# Altium schematic sheet 0064_HPD & WAKE SIGNALS.SchDoc
size 848 x 558 mm
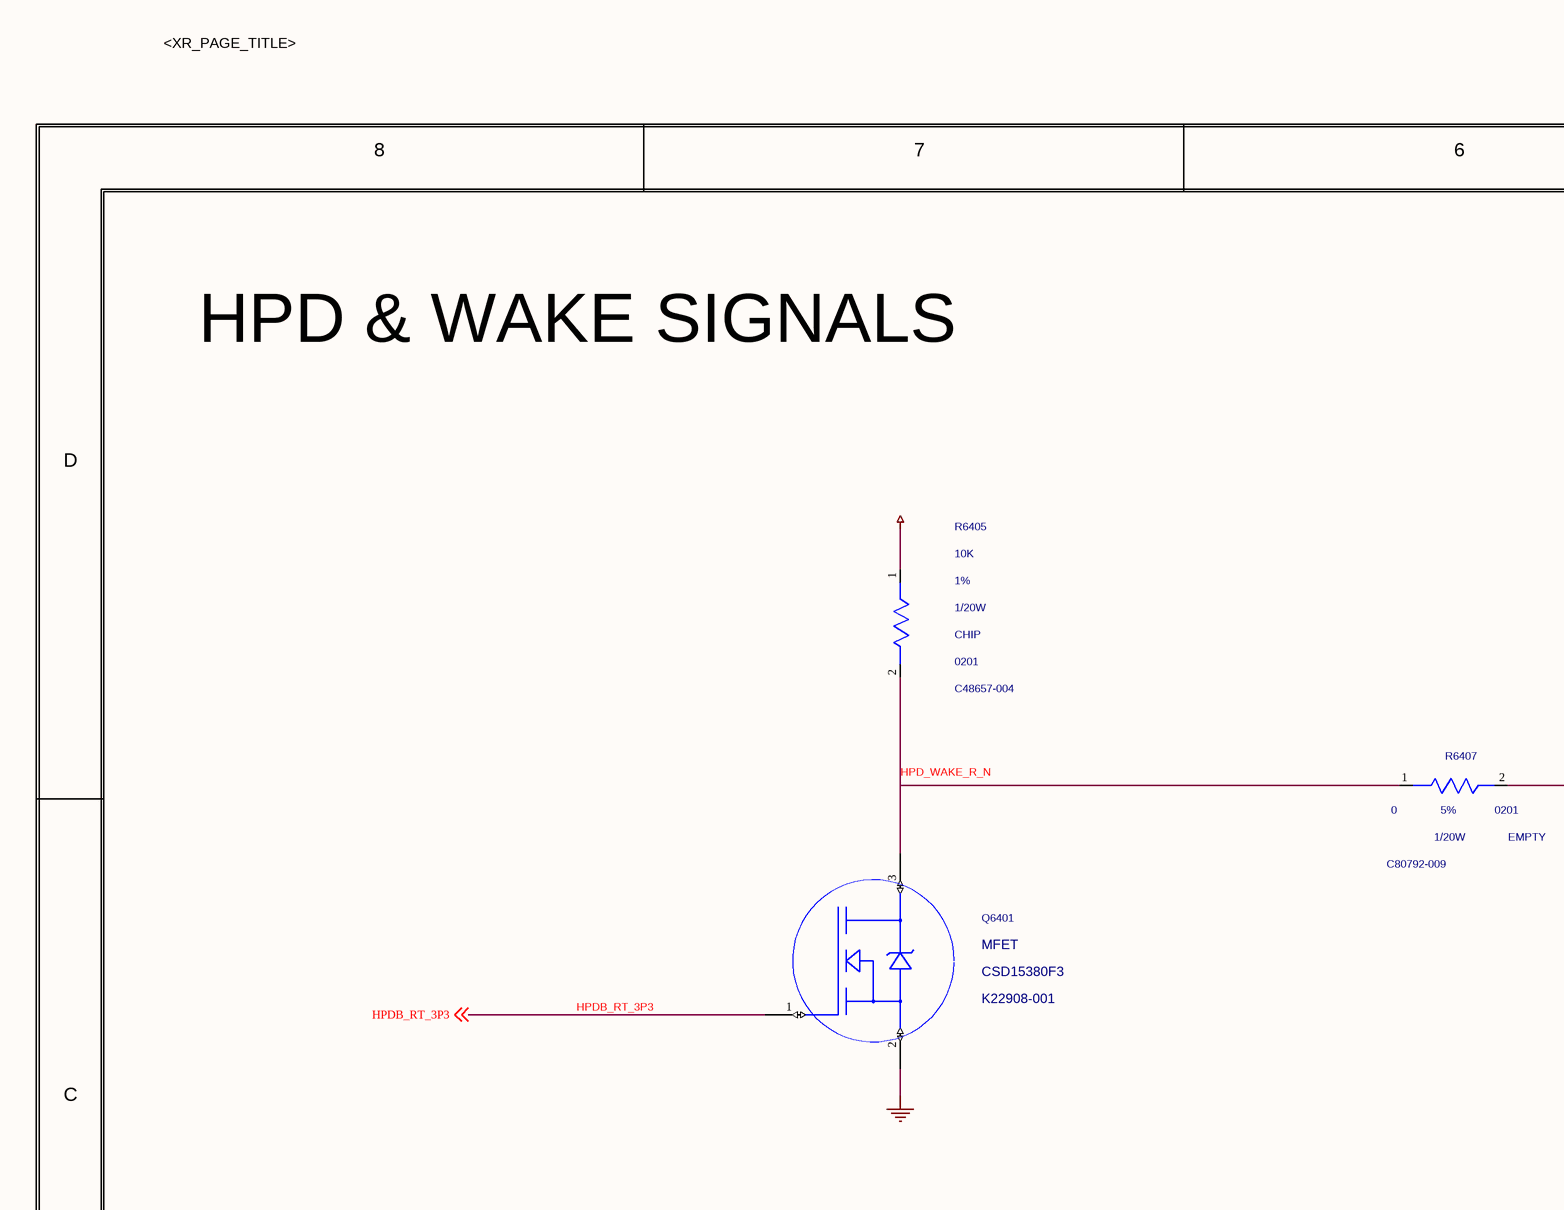
[diagram p0: 0064_HPD & WAKE SIGNALS.SchDoc, top left]
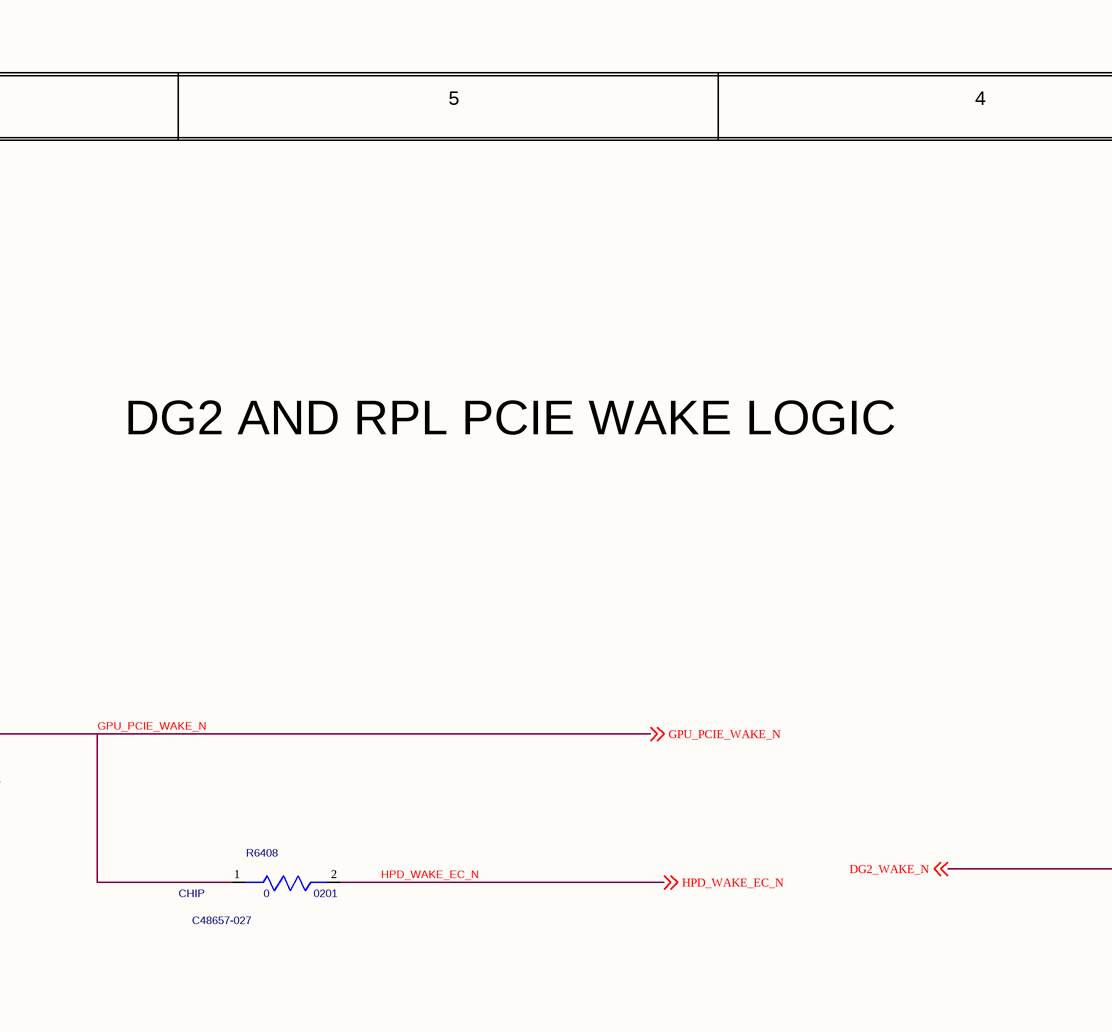
[diagram p1: 0064_HPD & WAKE SIGNALS.SchDoc, top middle]
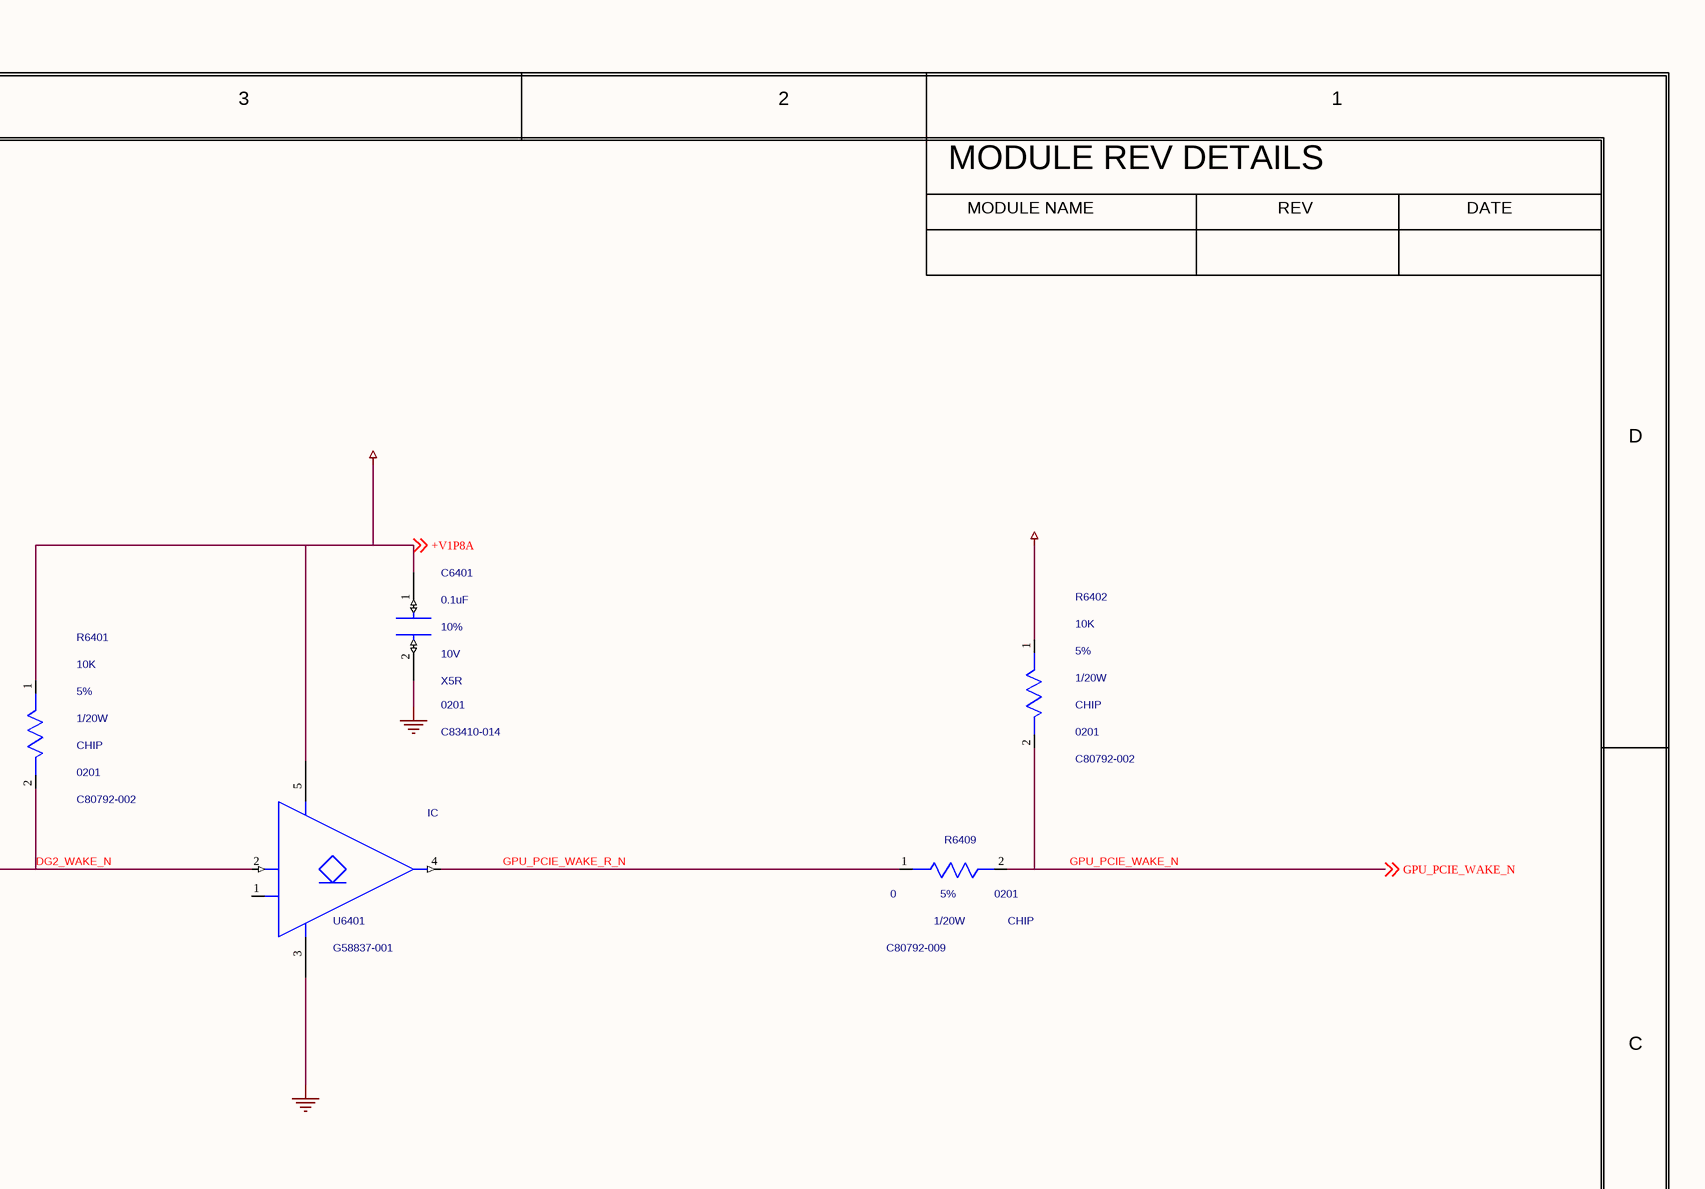
[diagram p2: 0064_HPD & WAKE SIGNALS.SchDoc, top right]
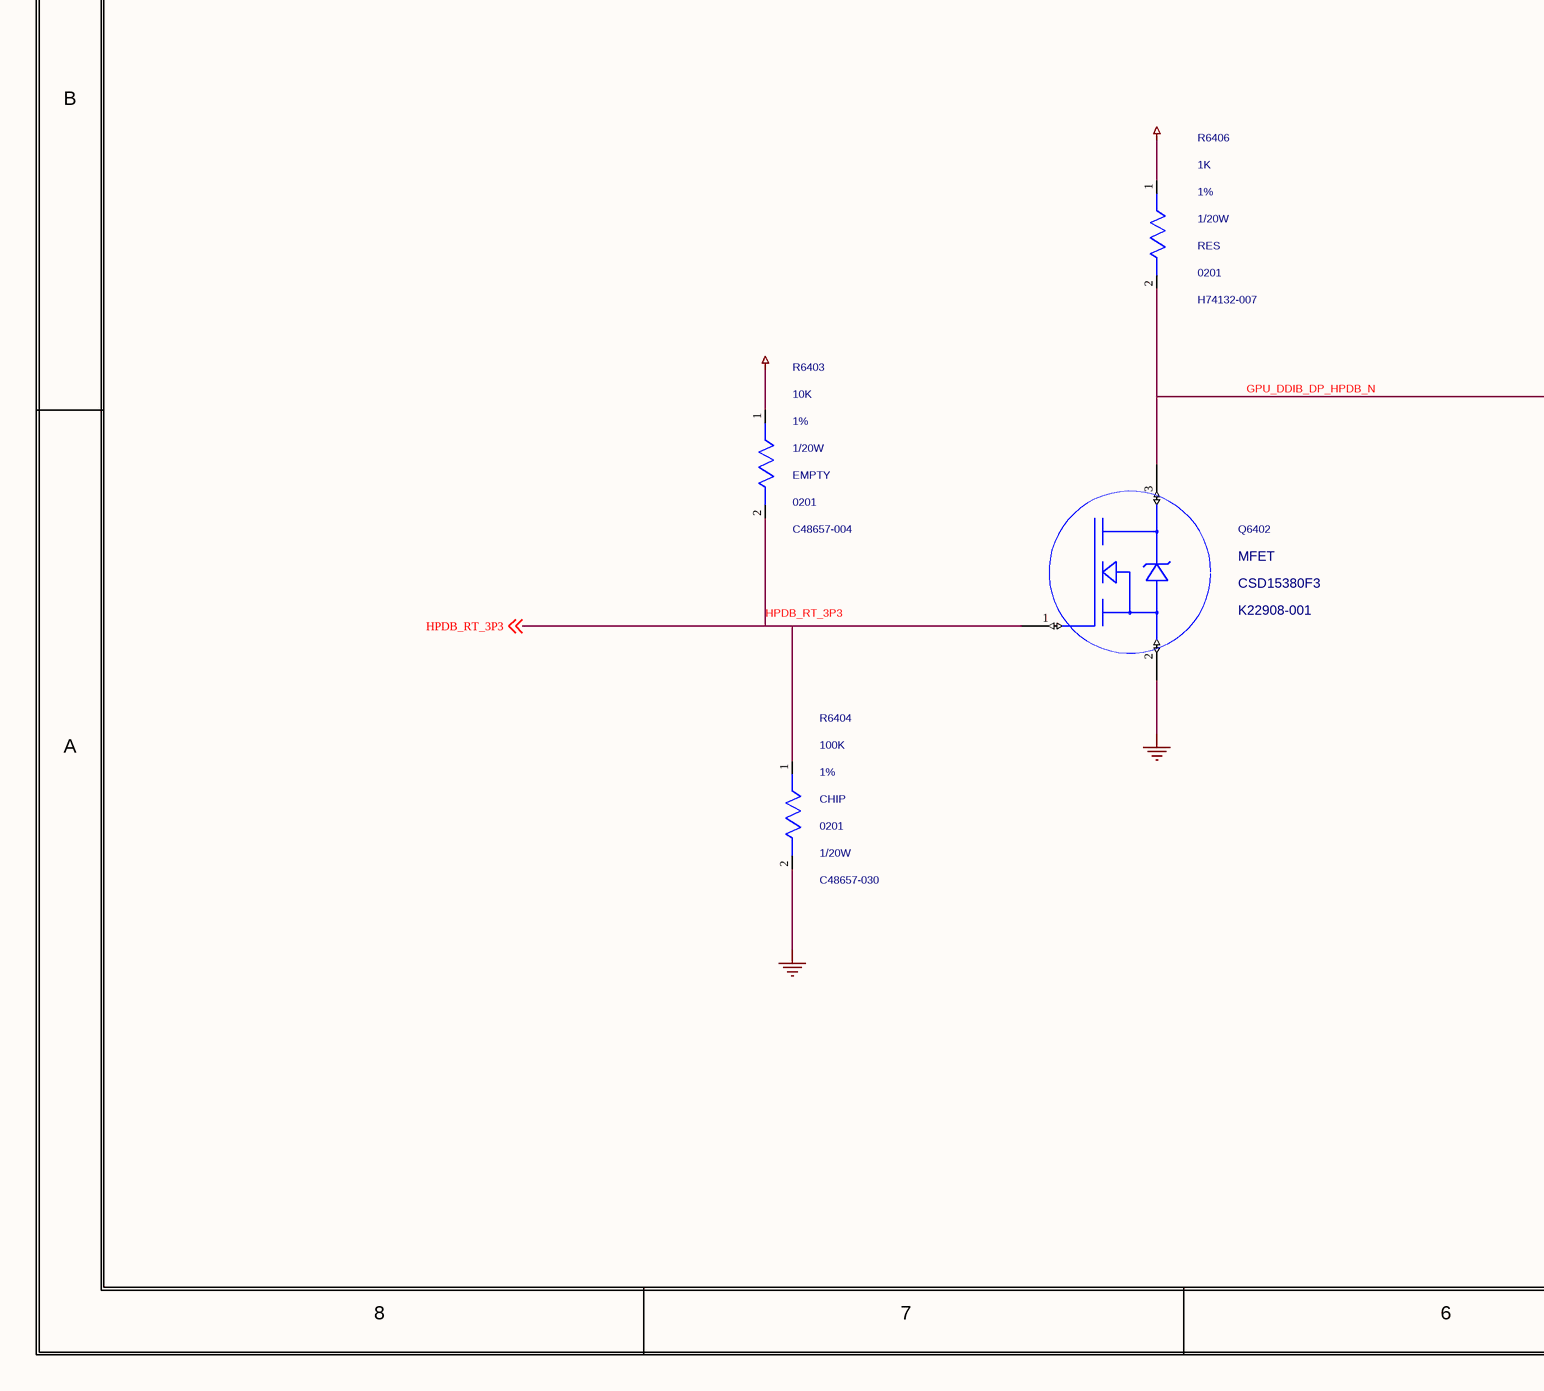
[diagram p3: 0064_HPD & WAKE SIGNALS.SchDoc, bottom left]
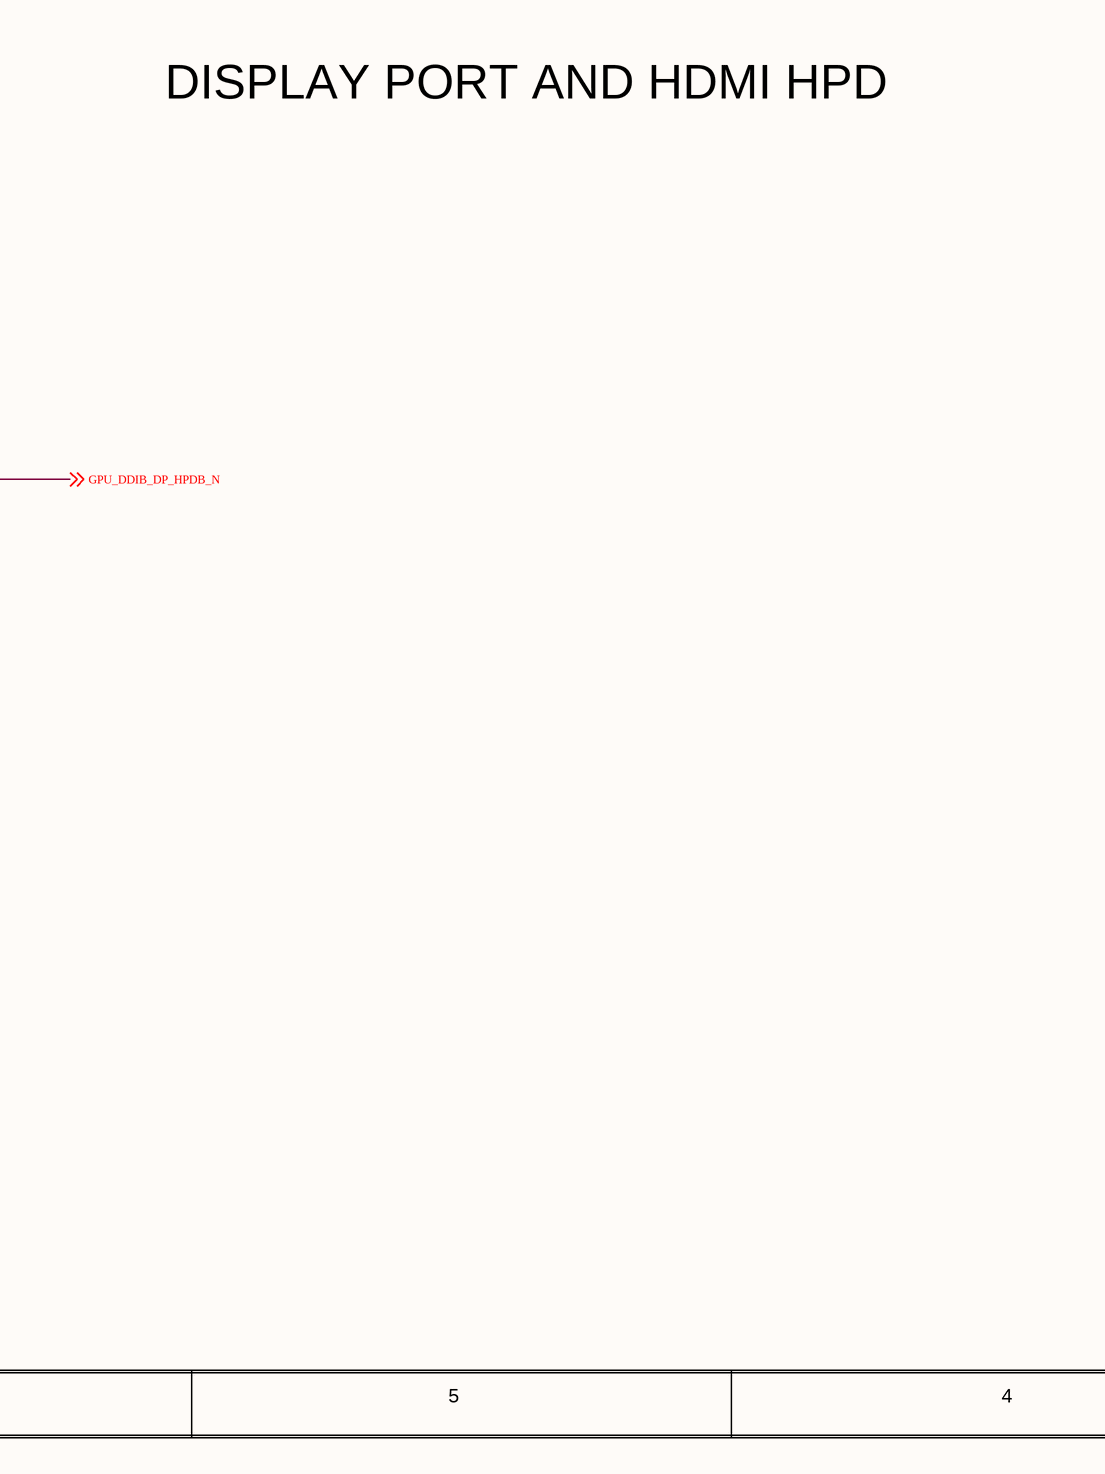
[diagram p4: 0064_HPD & WAKE SIGNALS.SchDoc, bottom middle]
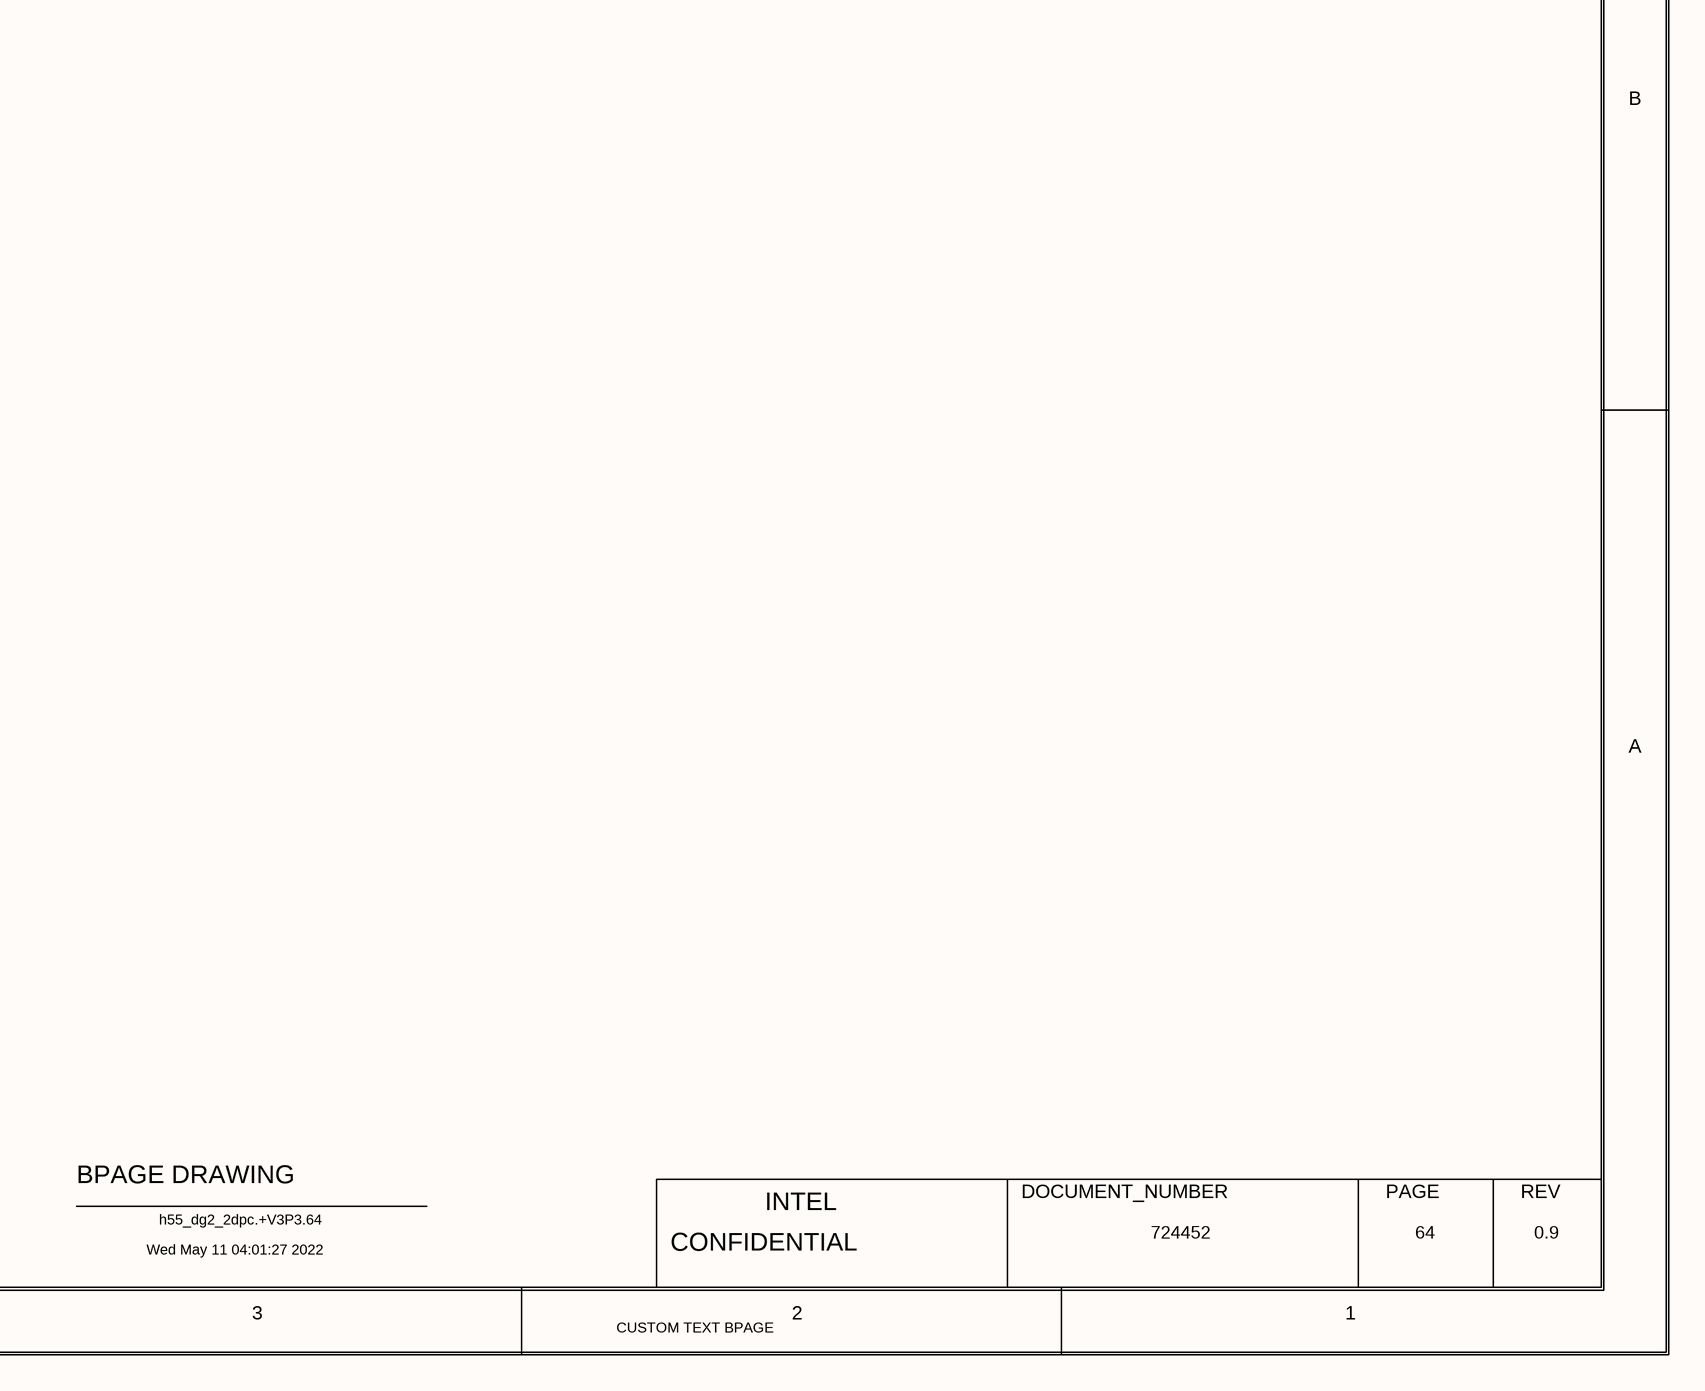
[diagram p5: 0064_HPD & WAKE SIGNALS.SchDoc, bottom right]

## Parts
C6401  0.1uF  MATERIAL: X5R  PACK_TYPE: 0201  PART_NUMBER: C83410-014  TOLERANCE: 10%  VOLTAGE: 10V  [SMC0201IA]
Q6401  CSD15380F3  MATERIAL: MFET  PART_NUMBER: K22908-001  [TK2_LCC3_730X640_350_MA]
Q6402  CSD15380F3  MATERIAL: MFET  PART_NUMBER: K22908-001  [TK2_LCC3_730X640_350_MA]
R6401  10K  MATERIAL: CHIP  PACK_TYPE: 0201  PART_NUMBER: C80792-002  TOLERANCE: 5%  WATTAGE: 1/20W  [SMR0201IA]
R6402  10K  MATERIAL: CHIP  PACK_TYPE: 0201  PART_NUMBER: C80792-002  TOLERANCE: 5%  WATTAGE: 1/20W  [SMR0201IA]
R6403  10K  MATERIAL: EMPTY  PACK_TYPE: 0201  PART_NUMBER: C48657-004  TOLERANCE: 1%  WATTAGE: 1/20W  [SMR0201IA]
R6404  100K  MATERIAL: CHIP  PACK_TYPE: 0201  PART_NUMBER: C48657-030  TOLERANCE: 1%  WATTAGE: 1/20W  [SMR0201MC]
R6405  10K  MATERIAL: CHIP  PACK_TYPE: 0201  PART_NUMBER: C48657-004  TOLERANCE: 1%  WATTAGE: 1/20W  [SMR0201IA]
R6406  1K  PACK_TYPE: 0201  PART_NUMBER: H74132-007  TOLERANCE: 1%  WATTAGE: 1/20W  [SMR0201IA]
R6407  0  MATERIAL: EMPTY  PACK_TYPE: 0201  PART_NUMBER: C80792-009  TOLERANCE: 5%  WATTAGE: 1/20W  [SMR0201IA]
R6408  0  MATERIAL: CHIP  PACK_TYPE: 0201  PART_NUMBER: C48657-027  [SMR0201IA]
R6409  0  MATERIAL: CHIP  PACK_TYPE: 0201  PART_NUMBER: C80792-009  TOLERANCE: 5%  WATTAGE: 1/20W  [SMR0201IA]
U6401  MATERIAL: IC  PART_NUMBER: G58837-001  [TSSOP5_21X13_65MA]  (hidden comment: TTL07)

## Nets
+V1P8A: C6401.1(A) R6401.1(A) R6406.1(A) U6401.5(VCC) ; off-sheet +V1P8A
+V3P3A: R6402.1(A) R6403.1(A) R6405.1(A)
GND: C6401.2(B) Q6401.2(SRC) Q6402.2(SRC) R6404.2(B) U6401.3(GND)
DG2_WAKE_N: R6401.2(B) U6401.2(A) ; off-sheet DG2_WAKE_N
GPU_DDIB_DP_HPDB_N: Q6402.3(DRN) R6406.2(B) ; off-sheet GPU_DDIB_DP_HPDB_N
GPU_PCIE_WAKE_N: R6402.2(B) R6407.2(B) R6408.1(A) R6409.2(B) ; off-sheet GPU_PCIE_WAKE_N
GPU_PCIE_WAKE_R_N: R6409.1(A) U6401.4(Y)
HPD_WAKE_EC_N: R6408.2(B) ; off-sheet HPD_WAKE_EC_N
HPD_WAKE_R_N: Q6401.3(DRN) R6405.2(B) R6407.1(A)
HPDB_RT_3P3: Q6401.1(GATE) Q6402.1(GATE) R6403.2(B) R6404.1(A) ; off-sheet HPDB_RT_3P3

Not connected (* = marked no-connect by the designer): U6401 1(NC)

## Notes on the sheet
- <XR_PAGE_TITLE>
- 8
- 7
- 6
- 5
- 4
- 3
- 2
- 1
- MODULE REV DETAILS
- MODULE NAME
- REV
- DATE
- HPD & WAKE SIGNALS
- D
- DG2 AND RPL PCIE WAKE LOGIC
- C
- DISPLAY PORT AND HDMI HPD
- B
- A
- BPAGE DRAWING
- INTEL
- DOCUMENT_NUMBER
- PAGE
- Wed May 11 04:01:27 2022
- h55_dg2_2dpc.+V3P3.64
- CONFIDENTIAL
- 724452
- 64
- 0.9
- CUSTOM TEXT BPAGE

## Library data of the parts
C6401 = CAP: CDS_PHYS_PART_NAME: CAP_0201-C83410-014,X5R,0.1UF,10V,10%,LPDB,GENERIC; OriginalSymbolOrigin: (-50,25); XY: (1725,3350); VER: 1; SUB_ROOM_2: MISC; SUB_ROOM_1: AP_SOC; SUB_ROOM: DECOUPLING; ROT: 2; PHYS_PAGE: 64; LOCATION: C6401; DRAWING: @RVP1_ADL_SB_ADP_S_DDR5_SODIMM_2DPC_LIB.H55_DG2_2DPC(SCH_1):PAGE64; CDS_LIB: discrete; PCB Footprint: SMC0201IA; SEC_TYPE: 0201; CHIPS_PART_NAME: CAP; CDS_PART_NAME: CAP_0201-C83410-014,X5R,0.1UF,10V,10%,LPDB,GENERIC; CDS_LOCATION: C6401
Q6401 = MOSFET_N_2: CDS_PHYS_PART_NAME: MOSFET_N_2_DFN-K22908-001,MFET,CSD15380F3,TK2,GENERIC; BOM_USE: STUFF; CDS_LMAN_SYM_OUTLINE: -200,200,200,-200; FP_TECH: TK2; IP: GENERIC; PACK_TYPE: DFN; ROOM: NONE; OriginalSymbolOrigin: (-125,125); XY: (-2650,2825); VER: 1; ROT: 0; PHYS_PAGE: 64; LOCATION: Q6401; DRAWING: @RVP1_ADL_SB_ADP_S_DDR5_SODIMM_2DPC_LIB.H55_DG2_2DPC(SCH_1):PAGE64; CDS_LIB: discrete_2; VARIANT: ?; PCB Footprint: TK2_LCC3_730X640_350_MA; CHIPS_PART_NAME: MOSFET_N_2; CDS_PART_NAME: MOSFET_N_2_DFN-K22908-001,MFET,CSD15380F3,TK2,GENERIC; CDS_LOCATION: Q6401
Q6402 = MOSFET_N_2: CDS_PHYS_PART_NAME: MOSFET_N_2_DFN-K22908-001,MFET,CSD15380F3,TK2,GENERIC; BOM_USE: STUFF; CDS_LMAN_SYM_OUTLINE: -200,200,200,-200; FP_TECH: TK2; IP: GENERIC; PACK_TYPE: DFN; ROOM: NONE; OriginalSymbolOrigin: (-125,125); XY: (-2175,575); VER: 1; ROT: 0; PHYS_PAGE: 64; LOCATION: Q6402; DRAWING: @RVP1_ADL_SB_ADP_S_DDR5_SODIMM_2DPC_LIB.H55_DG2_2DPC(SCH_1):PAGE64; CDS_LIB: discrete_2; VARIANT: ?; PCB Footprint: TK2_LCC3_730X640_350_MA; CHIPS_PART_NAME: MOSFET_N_2; CDS_PART_NAME: MOSFET_N_2_DFN-K22908-001,MFET,CSD15380F3,TK2,GENERIC; CDS_LOCATION: Q6402
R6401 = RES: CDS_PHYS_PART_NAME: RES_0201-C80792-002,CHIP,10K,5%,1/20W,LPDB,GENERIC; OriginalSymbolOrigin: (-25,75); XY: (1025,3150); VER: 2; SUB_ROOM_2: PUPD; SUB_ROOM_1: AP_SOC; PHYS_PAGE: 64; LOCATION: R6401; IP: GENERIC; FP_TECH: LPDB; DRAWING: @RVP1_ADL_SB_ADP_S_DDR5_SODIMM_2DPC_LIB.H55_DG2_2DPC(SCH_1):PAGE64; CDS_LIB: discrete; PCB Footprint: SMR0201IA; SUB_ROOM: PUPD; SEC_TYPE: 0201; ROT: 2; CHIPS_PART_NAME: RES; CDS_PART_NAME: RES_0201-C80792-002,CHIP,10K,5%,1/20W,LPDB,GENERIC; CDS_LOCATION: R6401
R6402 = RES: CDS_PHYS_PART_NAME: RES_0201-C80792-002,CHIP,10K,5%,1/20W,LPDB,GENERIC; OriginalSymbolOrigin: (-25,75); XY: (2875,3225); VER: 2; SUB_ROOM_2: PUPD; SUB_ROOM_1: AP_SOC; PHYS_PAGE: 64; LOCATION: R6402; IP: GENERIC; FP_TECH: LPDB; DRAWING: @RVP1_ADL_SB_ADP_S_DDR5_SODIMM_2DPC_LIB.H55_DG2_2DPC(SCH_1):PAGE64; CDS_LIB: discrete; PCB Footprint: SMR0201IA; SUB_ROOM: PUPD; SEC_TYPE: 0201; ROT: 2; CHIPS_PART_NAME: RES; CDS_PART_NAME: RES_0201-C80792-002,CHIP,10K,5%,1/20W,LPDB,GENERIC; CDS_LOCATION: R6402
R6403 = RES: CDS_PHYS_PART_NAME: RES_0201-C48657-004,EMPTY,10K,1%,1/20W,LPDB,GENERIC; OriginalSymbolOrigin: (-25,75); XY: (-2850,775); VER: 2; ROT: 0; PHYS_PAGE: 64; LOCATION: R6403; IP: GENERIC; FP_TECH: LPDB; DRAWING: @RVP1_ADL_SB_ADP_S_DDR5_SODIMM_2DPC_LIB.H55_DG2_2DPC(SCH_1):PAGE64; CDS_LIB: discrete; PCB Footprint: SMR0201IA; CHIPS_PART_NAME: RES; CDS_PART_NAME: RES_0201-C48657-004,EMPTY,10K,1%,1/20W,LPDB,GENERIC; CDS_LOCATION: R6403
R6404 = RES: CDS_PHYS_PART_NAME: RES_0201-C48657-030,CHIP,100K,1%,1/20W,LPDB,GENERIC; OriginalSymbolOrigin: (-25,75); XY: (-2800,125); VER: 2; SUITE: ADL; SUB_ROOM: HPD; ROT: 0; ROOM1: MISC; PHYS_PAGE: 64; LOCATION: R6404; IP: GENERIC; FP_TECH: LPDB; DRAWING: @RVP1_ADL_SB_ADP_S_DDR5_SODIMM_2DPC_LIB.H55_DG2_2DPC(SCH_1):PAGE64; CONFIG: GENERAL; CDS_LIB: discrete; PCB Footprint: SMR0201MC; CHIPS_PART_NAME: RES; CDS_PART_NAME: RES_0201-C48657-030,CHIP,100K,1%,1/20W,LPDB,GENERIC; CDS_LOCATION: R6404
R6405 = RES: CDS_PHYS_PART_NAME: RES_0201-C48657-004,CHIP,10K,1%,1/20W,LPDB,GENERIC; OriginalSymbolOrigin: (-25,75); XY: (-2600,3450); VER: 2; ROT: 0; PHYS_PAGE: 64; LOCATION: R6405; IP: GENERIC; FP_TECH: LPDB; DRAWING: @RVP1_ADL_SB_ADP_S_DDR5_SODIMM_2DPC_LIB.H55_DG2_2DPC(SCH_1):PAGE64; CDS_LIB: discrete; PCB Footprint: SMR0201IA; CHIPS_PART_NAME: RES; CDS_PART_NAME: RES_0201-C48657-004,CHIP,10K,1%,1/20W,LPDB,GENERIC; CDS_LOCATION: R6405
R6406 = RES: CDS_PHYS_PART_NAME: RES_0201-H74132-007,RES,1K,1%,1/20W,LPDB,GENERIC; OriginalSymbolOrigin: (-25,75); XY: (-2125,1200); VER: 2; ROT: 0; PHYS_PAGE: 64; LOCATION: R6406; IP: GENERIC; FP_TECH: LPDB; DRAWING: @RVP1_ADL_SB_ADP_S_DDR5_SODIMM_2DPC_LIB.H55_DG2_2DPC(SCH_1):PAGE64; CDS_LIB: discrete; MATERIAL: RES; PCB Footprint: SMR0201IA; CHIPS_PART_NAME: RES; CDS_PART_NAME: RES_0201-H74132-007,RES,1K,1%,1/20W,LPDB,GENERIC; CDS_LOCATION: R6406
R6407 = RES#1: CHIPS_PART_NAME: RES; CDS_PHYS_PART_NAME: RES_0201-C80792-009,EMPTY,0,5%,1/20W,LPDB,GENERIC; OriginalSymbolOrigin: (-75,25); XY: (-1575,3150); VER: 1; SUITE: ADL; SUB_ROOM: HPD; ROOM1: MISC; PHYS_PAGE: 64; LOCATION: R6407; IP: GENERIC; FP_TECH: LPDB; DRAWING: @RVP1_ADL_SB_ADP_S_DDR5_SODIMM_2DPC_LIB.H55_DG2_2DPC(SCH_1):PAGE64; CONFIG: GENERAL; CDS_LIB: discrete; PCB Footprint: SMR0201IA; ROT: 0; CDS_PART_NAME: RES_0201-C80792-009,EMPTY,0,5%,1/20W,LPDB,GENERIC; CDS_LOCATION: R6407
R6408 = RES#1: CHIPS_PART_NAME: RES; CDS_PHYS_PART_NAME: RES_0201-C80792-009,CHIP,0,5%,1/20W,LPDB,GENERIC; CDS_PART_NAME: RES_0201-C48657-027,CHIP,0,1%,1/20W,LPDB,GENERIC; TOLERANCE: 1%; WATTAGE: 1/20W; OriginalSymbolOrigin: (-75,25); XY: (-875,2875); VER: 1; SUITE: ADL; SUB_ROOM: HPD; ROOM1: MISC; PHYS_PAGE: 64; LOCATION: R6408; IP: GENERIC; FP_TECH: LPDB; DRAWING: @RVP1_ADL_SB_ADP_S_DDR5_SODIMM_2DPC_LIB.H55_DG2_2DPC(SCH_1):PAGE64; CONFIG: GENERAL; CDS_LIB: discrete; PCB Footprint: SMR0201IA; ROT: 0; CDS_LOCATION: R6408
R6409 = RES#1: CHIPS_PART_NAME: RES; CDS_PHYS_PART_NAME: RES_0201-C80792-009,CHIP,0,5%,1/20W,LPDB,GENERIC; OriginalSymbolOrigin: (-75,25); XY: (2725,2900); VER: 1; SUITE: ADL; SUB_ROOM: HPD; ROOM1: MISC; PHYS_PAGE: 64; LOCATION: R6409; IP: GENERIC; FP_TECH: LPDB; DRAWING: @RVP1_ADL_SB_ADP_S_DDR5_SODIMM_2DPC_LIB.H55_DG2_2DPC(SCH_1):PAGE64; CONFIG: GENERAL; CDS_LIB: discrete; PCB Footprint: SMR0201IA; ROT: 0; CDS_PART_NAME: RES_0201-C80792-009,CHIP,0,5%,1/20W,LPDB,GENERIC; CDS_LOCATION: R6409
U6401 = TTL07: CDS_PHYS_PART_NAME: TTL07_SM-G58837-001,IC,74AUP1G07GW,LPDB,GENERIC; CDS_LMAN_SYM_OUTLINE: -100,150,150,-150; PACK_TYPE: SM; OriginalSymbolOrigin: (-125,125); XY: (1575,2900); VER: 1; SUB_ROOM_2: MISC; SUB_ROOM_1: AP_SOC; ROT: 0; PHYS_PAGE: 64; LOCATION: U6401; DRAWING: @RVP1_ADL_SB_ADP_S_DDR5_SODIMM_2DPC_LIB.H55_DG2_2DPC(SCH_1):PAGE64; CDS_LIB: ttl; PCB Footprint: TSSOP5_21X13_65MA; SUB_ROOM: MISC; SEC_TYPE: SM; CHIPS_PART_NAME: TTL07; CDS_PART_NAME: TTL07_SM-G58837-001,IC,74AUP1G07GW,LPDB,GENERIC; CDS_LOCATION: U6401